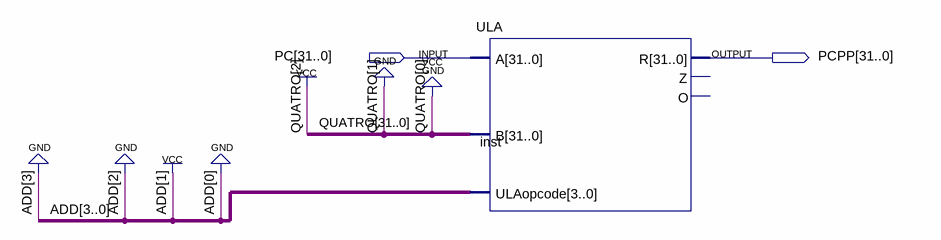
[diagram p0: schematic sheet]
// Quartus schematic PCpp.bdf as structural Verilog: 1 symbols, 2 pins
module PCpp (
  input  [31:0] PC,
  output [31:0] PCPP
);

  wire [31:3] QUATRO;

  ULA inst (.ULAopcode(4'b0010), .A(PC), .B({QUATRO, 3'b100}), .R(PCPP));  // open: Z, O
endmodule
